# Altium schematic sheet SunS_fixture_EGSE_Top.SchDoc: Top
size A3; Author: Michał Gumiela; ProjectName: SunS
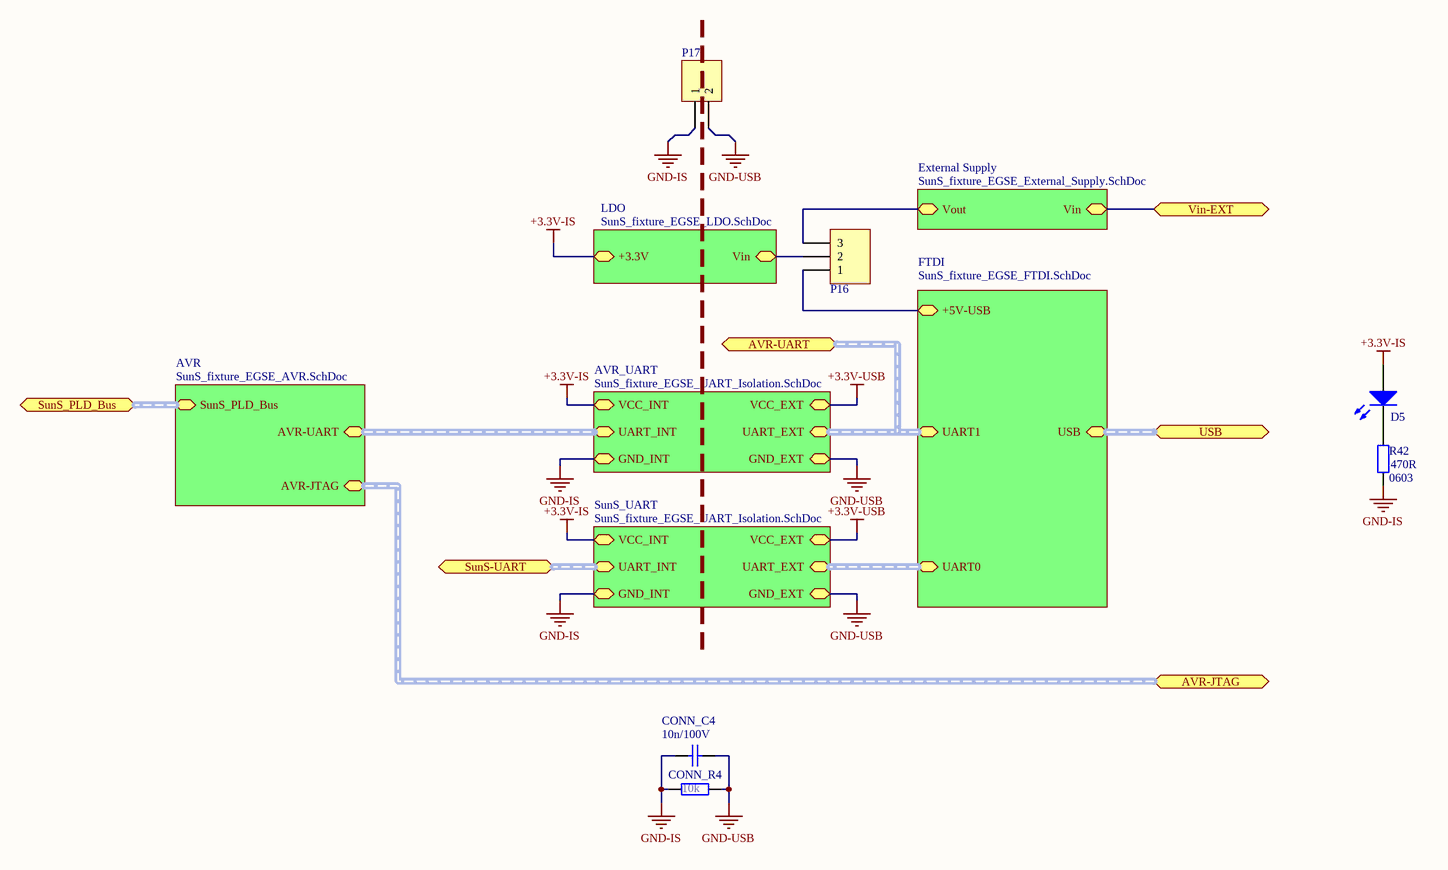
[diagram p0: SunS_fixture_EGSE_Top.SchDoc]

## Parts
CONN_C4  10n/100V  [SMD_Capacitor_0805]
CONN_R4  10k  [SMD_Resistor_0805]
D5  LEDX  [LED 0805 RED]  (value not drawn)
P16  Header 3  [HEADER 1X3 MALE]  (value not drawn)
P17  Header 2  [HEADER 1X2 Male]  (value not drawn)
R42  Package: 0603  [SMD_Resistor_0603]  (hidden comment: 470R)

## Sub-sheets
AVR = SunS_fixture_EGSE_AVR.SchDoc: SunS_PLD_Bus (harness SunS_PLD_Bus), AVR-UART (harness UART), AVR-JTAG (harness JTAG)
AVR_UART = SunS_fixture_EGSE_UART_Isolation.SchDoc: UART_INT (harness UART), UART_EXT (harness UART), GND_INT, VCC_INT, GND_EXT, VCC_EXT
External Supply = SunS_fixture_EGSE_External_Supply.SchDoc: Vout, Vin
FTDI = SunS_fixture_EGSE_FTDI.SchDoc: UART0 (harness UART), UART1 (harness UART), USB (harness USB), +5V-USB
LDO = SunS_fixture_EGSE_LDO.SchDoc: Vin, +3.3V
SunS_UART = SunS_fixture_EGSE_UART_Isolation.SchDoc: UART_INT (harness UART), UART_EXT (harness UART), GND_INT, VCC_INT, GND_EXT, VCC_EXT

## Ports
AVR-JTAG (harness JTAG), AVR-UART (harness UART), SunS-UART (harness UART), SunS_PLD_Bus (harness SunS_PLD_Bus), USB (harness SunS_PLD_Bus), Vin-EXT

## Nets
+3.3V-IS: D5.1(A) ; sheet SunS_UART/VCC_INT, sheet LDO/+3.3V, sheet AVR_UART/VCC_INT
+3.3V-USB: sheet SunS_UART/VCC_EXT, sheet AVR_UART/VCC_EXT
GND-IS: CONN_C4.1 CONN_R4.1 P17.1 R42.1 ; sheet SunS_UART/GND_INT, sheet AVR_UART/GND_INT
GND-USB: CONN_C4.2 CONN_R4.2 P17.2 ; sheet SunS_UART/GND_EXT, sheet AVR_UART/GND_EXT
Vin-EXT: port Vin-EXT, sheet External Supply/Vin
NetD5_2: D5.2(K) R42.2
NetP16_1: P16.1 ; sheet FTDI/+5V-USB
NetP16_2: P16.2 ; sheet LDO/Vin
NetP16_3: P16.3 ; sheet External Supply/Vout

## Buses and harness runs
harness port AVR-JTAG = sheet AVR/AVR-JTAG
harness port AVR-UART = sheet AVR_UART/UART_EXT = sheet FTDI/UART1
harness port SunS-UART = sheet SunS_UART/UART_INT
harness port SunS_PLD_Bus = sheet AVR/SunS_PLD_Bus
harness port USB = sheet FTDI/USB
harness sheet AVR/AVR-UART = sheet AVR_UART/UART_INT
harness sheet FTDI/UART0 = sheet SunS_UART/UART_EXT

## Notes on the sheet
- Title:
- Project:
- Author:
- Model:
- Document Number:
- Checked by:
- Rev:
- Date:
- Approved by:
- Sheet:
- of
- File name:

## Library data of the parts
CONN_C4 = Cer_C0805T104K1RCLTU: Ceramic Cap Kemet COTS 100n/100V X7R 0805; ManufacturerPartNumber: C0805T104K1RCLTU; Manufacturer: Kemet; Package: 0805; Value: 10n/100V
CONN_R4 = CRCW08051K00FKxxxx: 1k/1% Vishay CRCW 0805 Resistor. 125mW, 100ppm, 150V.; Manufacturer: Vishay; ManufacturerPartNumber: CRCW08051K00FKxxxx; Value: 10k; Package: 0805
D5 = LEDX: Typical LED
P16 = Header 3: Header, 3-Pin; LatestRevisionDate: 17-Jul-2002; LatestRevisionNote: Re-released for DXP Platform.; Publisher: Altium Limited
P17 = Header 2: Header, 2-Pin; LatestRevisionDate: 17-Jul-2002; LatestRevisionNote: Re-released for DXP Platform.; Publisher: Altium Limited
R42 = Res: Value: 470R